# EAGLE design EMILL (EAGLE 9.5.1)
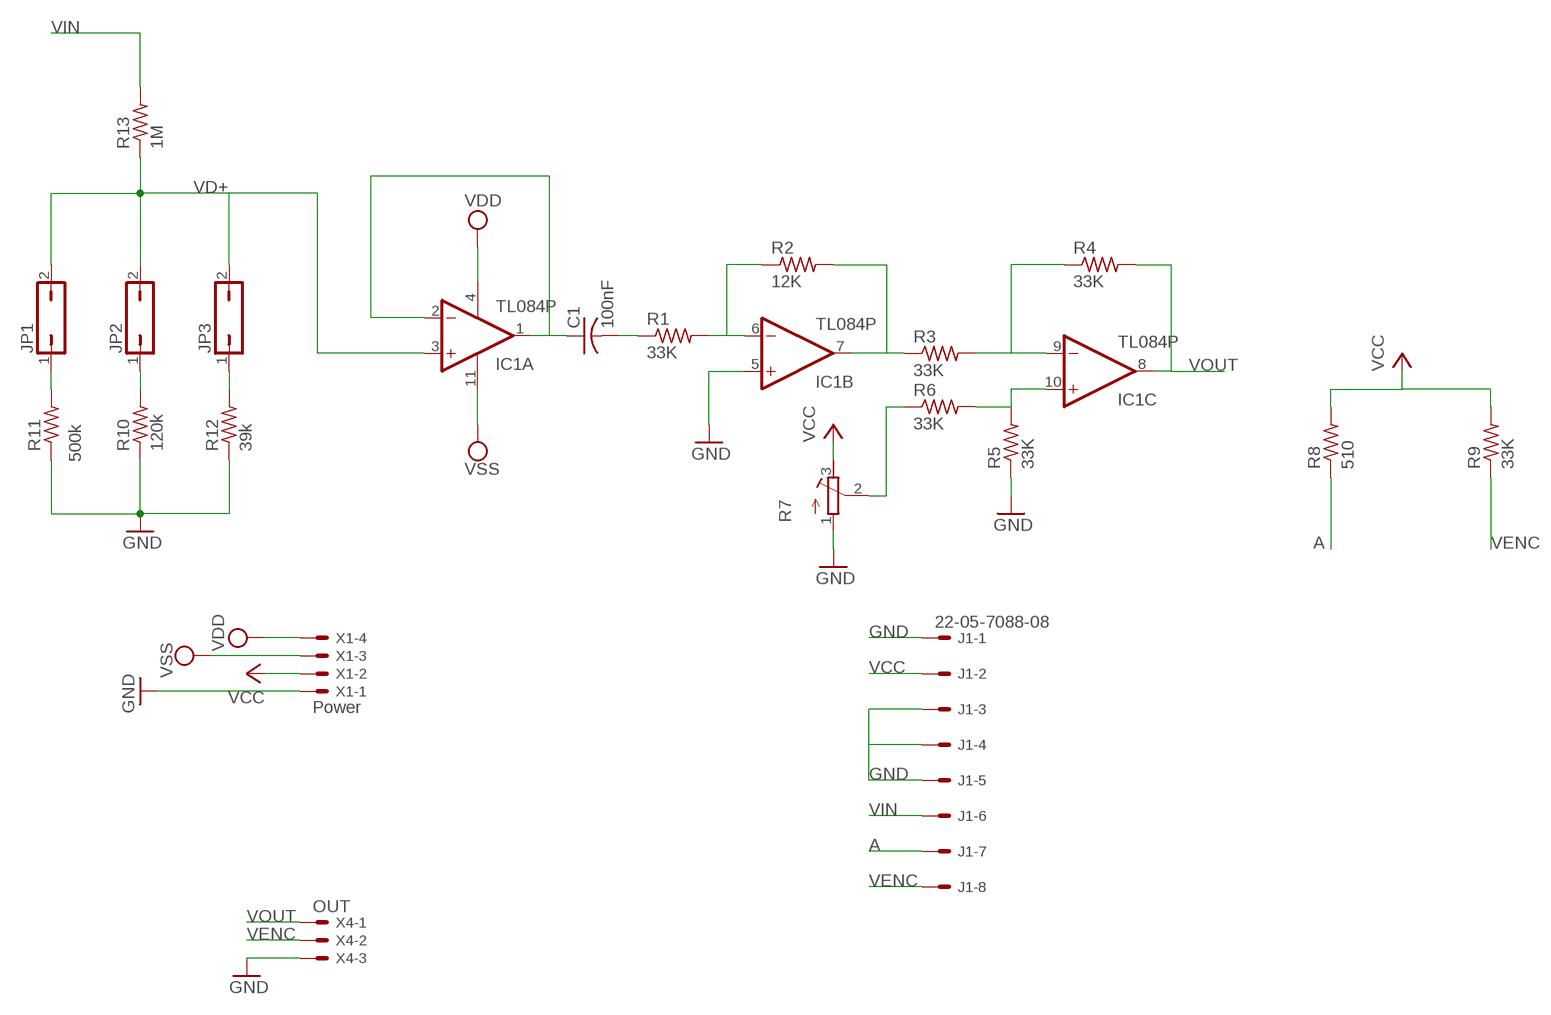
[diagram p0: schematic, sheet 1]

## Parts
C1  100nF  C-US025-025X050  [C025-025X050]
IC1  TL084P  [DIL14]
J1  22-05-7088-08  [7395-08]
JP1  JP1Q  [JP1]
JP2  JP1Q  [JP1]
JP3  JP1Q  [JP1]
R1  33K  R-US_0207/10  [0207/10]
R2  12K  R-US_0207/10  [0207/10]
R3  33K  R-US_0207/10  [0207/10]
R4  33K  R-US_0207/10  [0207/10]
R5  33K  R-US_0207/10  [0207/10]
R6  33K  R-US_0207/10  [0207/10]
R7  R-TRIMM64W  [RTRIM64W]
R8  510  R-US_0207/10  [0207/10]
R9  33K  R-US_0207/10  [0207/10]
R10  120k  R-US_0207/10  [0207/10]
R11  500k  R-US_0207/10  [0207/10]
R12  39k  R-US_0207/10  [0207/10]
R13  1M  R-US_0207/10  [0207/10]
X1  Power  22-23-2041  [22-23-2041]
X4  OUT  22-23-2031  [22-23-2031]

## Nets
A: J1.7 R8.1
GND: IC1.5(B:+IN) J1.1 J1.3 J1.4 J1.5 R5.1 R7.1(A) R10.1 R11.1 R12.1 X1.1 X4.3
N$1: C1.1 IC1.1(A:OUT) IC1.2(A:-IN)
N$2: C1.2 R1.1
N$3: IC1.6(B:-IN) R1.2 R2.1
N$4: IC1.7(B:OUT) R2.2 R3.1
N$5: IC1.9(C:-IN) R3.2 R4.1
N$6: IC1.10(C:+IN) R5.2 R6.2
N$8: R6.1 R7.2(S)
N$13: JP2.1 R10.2
N$14: JP3.1 R12.2
N$15: JP1.1 R11.2
VCC: J1.2 R7.3(E) R8.2 R9.2 X1.2
VD+: IC1.3(A:+IN) JP1.2 JP2.2 JP3.2 R13.1
VDD: IC1.4(P:V+) X1.4
VENC: J1.8 R9.1 X4.2
VIN: J1.6 R13.2
VOUT: IC1.8(C:OUT) R4.2 X4.1
VSS: IC1.11(P:V-) X1.3
Unconnected: IC1.12(D:+IN) IC1.13(D:-IN) IC1.14(D:OUT)

## Library data of the parts
C1 = rcl:C-US: CAPACITOR, American symbol
IC1 = linear:TL084: OP AMP
J1 = con-molex:22-?-08: CONNECTOR wire to board 2.54 mm (.1 inch) pitch header; MF: MOLEX; OC_FARNELL: unknown; OC_NEWARK: unknown
JP1-JP3 = jumper:JP1Q: JUMPER
R1-R6 R8-R13 = rcl:R-US_: RESISTOR, American symbol
R7 = rcl:R-TRIMM: Trimm resistor
X1 = con-molex:22-23-2041: .100" (2.54mm) Center Header - 4 Pin; MF: MOLEX; MPN: 22-23-2041; OC_FARNELL: 1462920; OC_NEWARK: 38C0355
X4 = con-molex:22-23-2031: .100" (2.54mm) Center Header - 3 Pin; MF: MOLEX; MPN: 22-23-2031; OC_FARNELL: 1462950; OC_NEWARK: 30C0862

## Board
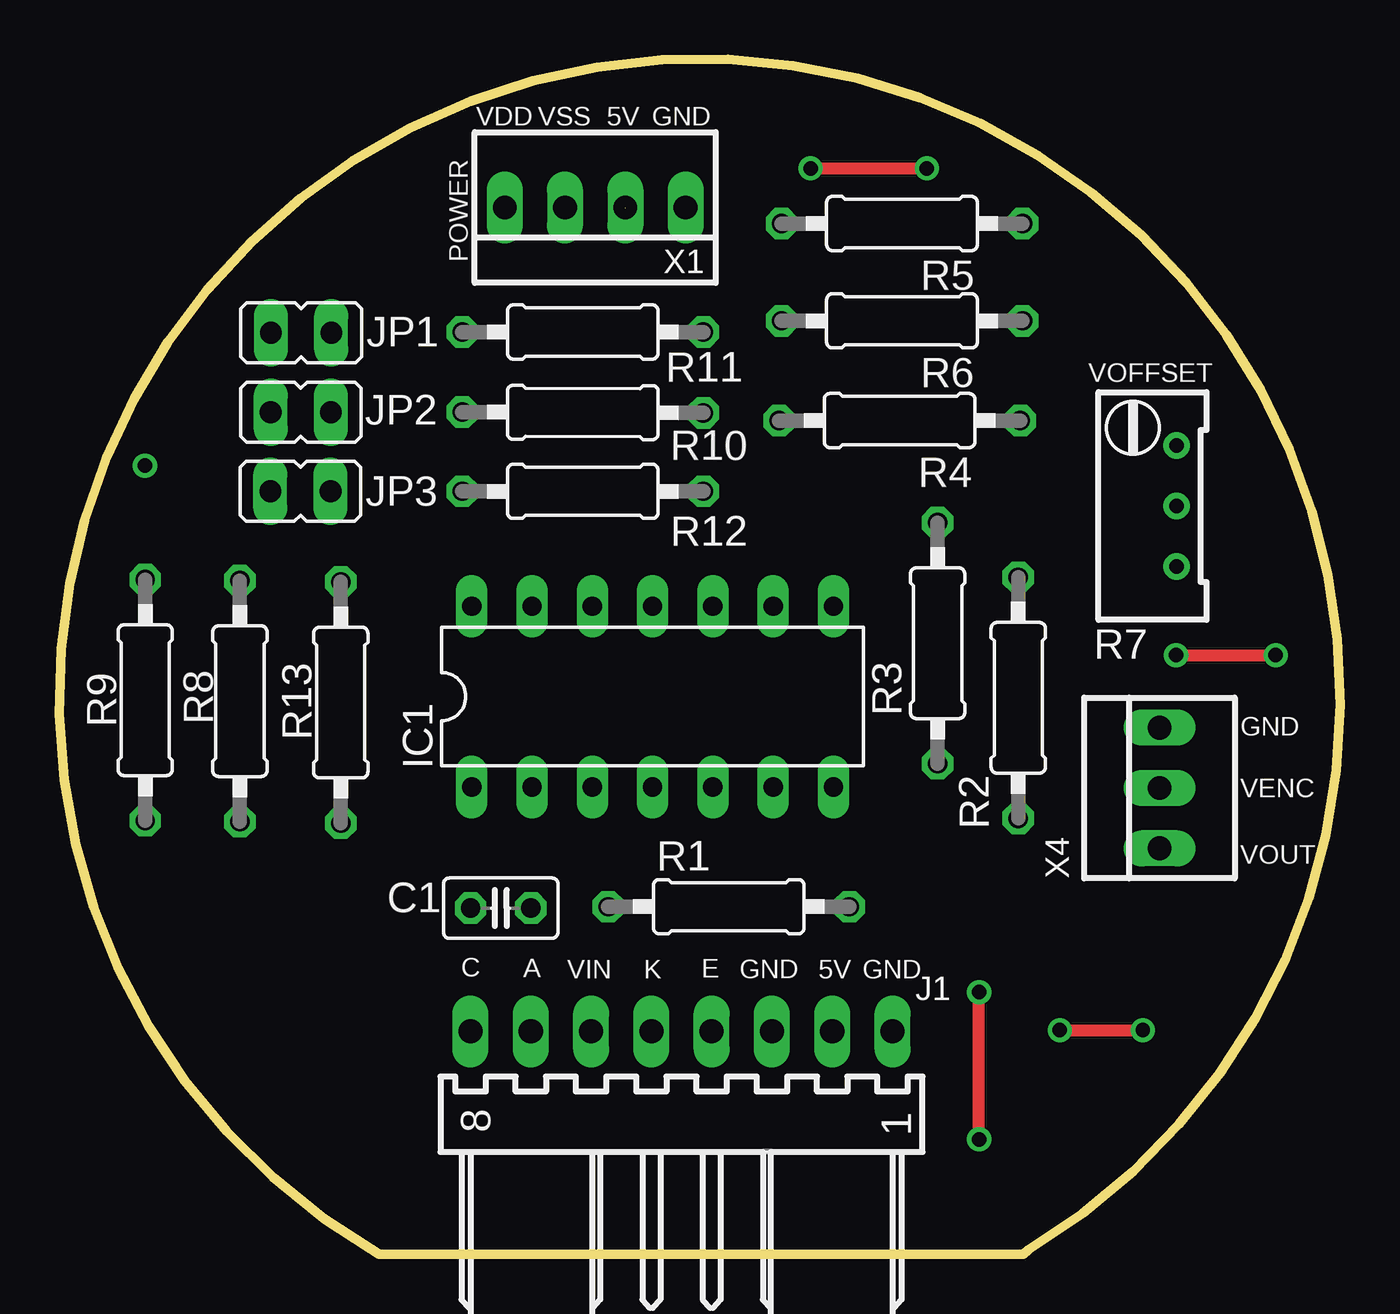
[diagram p1: board, top side]
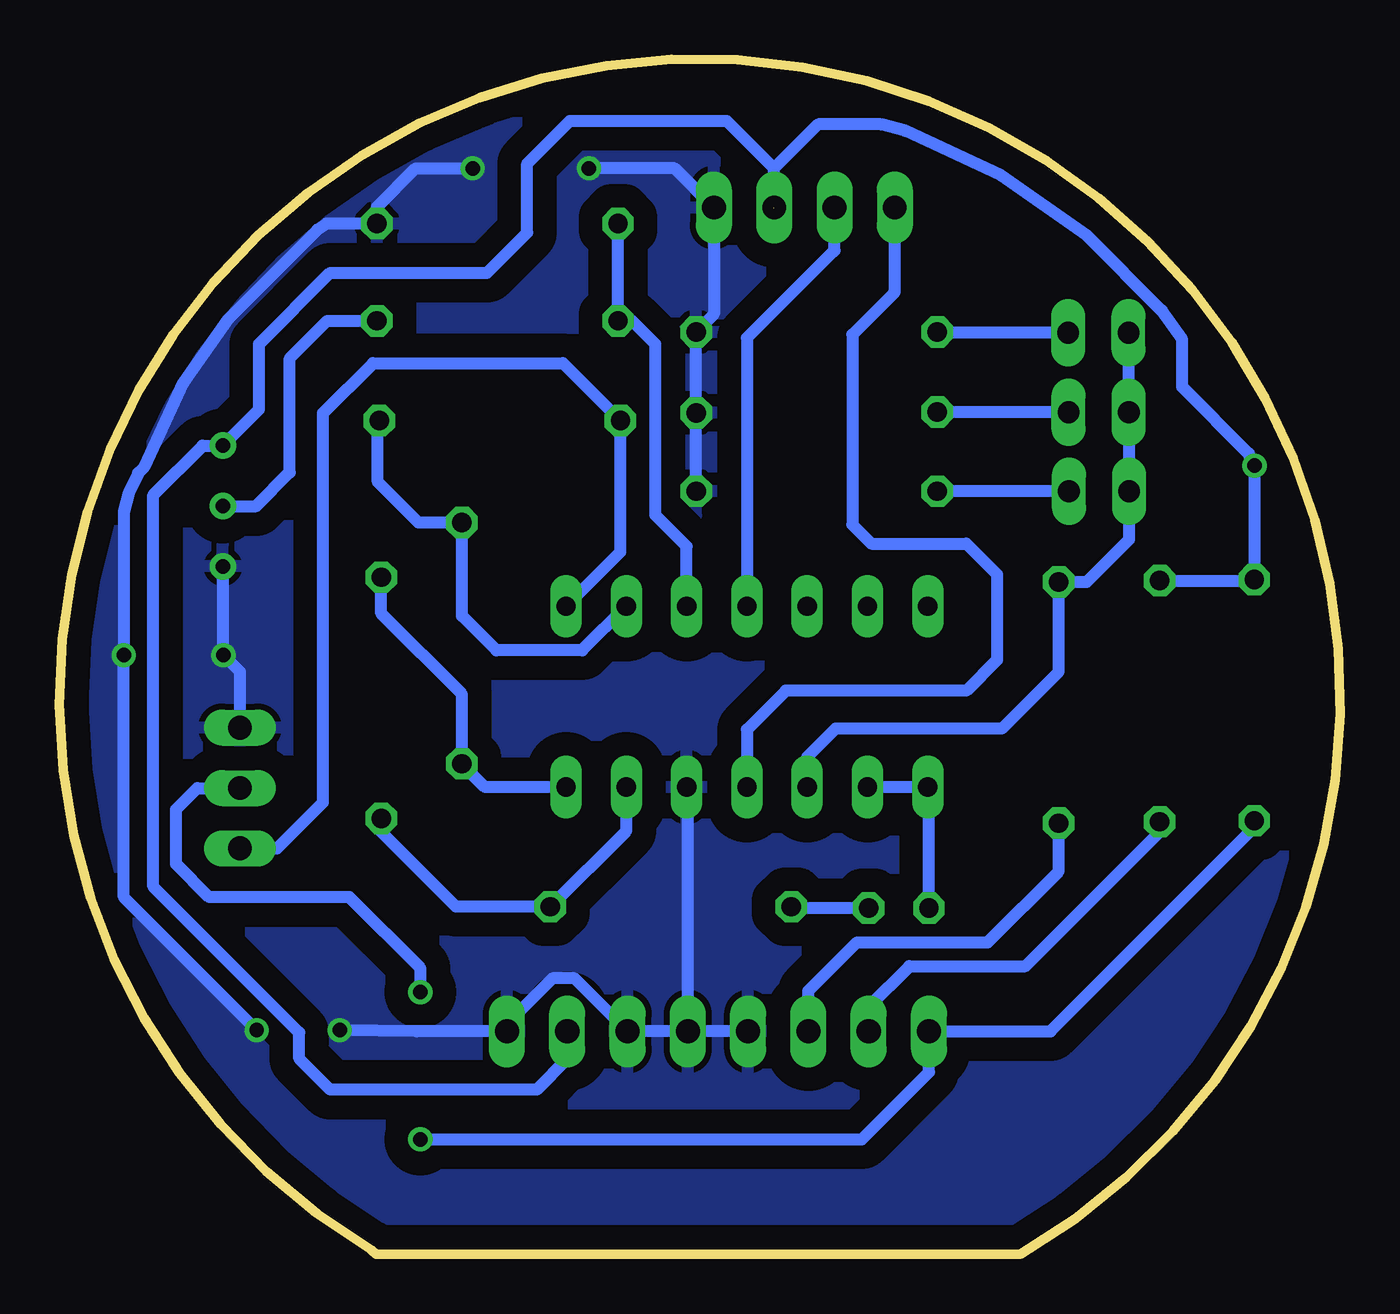
[diagram p2: board, bottom side, seen from below]

Size 53.97 x 50.35 mm. Coordinates in mm from the lower left corner, seen from the top.
Outline: 13.48,0.01 arc-299 40.83,0.21 40.62,0 13.5,0
Copper layers (1*16): Top 0.035mm / dielectric 1.5mm / Bottom 0.035mm
Design rules "default": minimum track width 10mil, minimum drill 24mil, track to track 8mil, track to pad 8mil, pad to pad 8mil, via to via 8mil, smd to smd 8mil, copper to edge 40mil, drill to drill 8mil, minimum pad ring 10mil, minimum via ring 8mil, stop-mask expansion 4mil, vias tented up to drill 0mil, thermal gap 10mil

### Footprints (pad centres in the part's own frame; a part is rotated, then mirrored left to right if it is on the bottom)
C025-025X050 = drill 0.813 octagon: 1 -1.27,0; 2 1.27,0
DIL14 = drill 0.813 long: 1 -7.62,-3.81; 2 -5.08,-3.81; 3 -2.54,-3.81; 4 0,-3.81; 5 2.54,-3.81; 6 5.08,-3.81; 7 7.62,-3.81; 8 7.62,3.81; 9 5.08,3.81; 10 2.54,3.81; 11 0,3.81; 12 -2.54,3.81; 13 -5.08,3.81; 14 -7.62,3.81
7395-08 = drill 1.016 long: 1 8.89,0; 2 6.35,0; 3 3.81,0; 4 1.27,0; 5 -1.27,0; 6 -3.81,0; 7 -6.35,0; 8 -8.89,0
JP1 = drill 0.914 long: 1 0,-1.27; 2 0,1.27
0207/10 = drill 0.813 octagon: 1 -5.08,0; 2 5.08,0
RTRIM64W = drill 0.61: 1 1.27,-2.54; 2 1.27,0; 3 1.27,2.54
22-23-2041 = drill 1 long: 1 -3.81,0; 2 -1.27,0; 3 1.27,0; 4 3.81,0
22-23-2031 = drill 1 long: 1 -2.54,0; 2 0,0; 3 2.54,0

### Placement (x,y rotation side)
C1  18.6,14.59 0 top
IC1  25,23.5 0 top
J1  26.22,9.4 0 top
JP1  10.19,38.83 90 top
JP2  10.18,35.48 90 top
JP3  10.16,32.15 90 top
R1  28.21,14.65 0 top
R2  40.41,23.45 90 top
R3  37.01,25.75 90 top
R4  35.41,35.13 180 top
R5  35.51,43.43 180 top
R6  35.51,39.33 180 top
R7  45.82,31.53 0 top
R8  7.61,23.31 90 top
R9  3.62,23.35 90 top
R10  22.06,35.47 179.8 top
R11  22.06,38.86 180 top
R12  22.06,32.15 180 top
R13  11.86,23.25 270 top
X1  22.58,44.1 180 top
X4  46.36,19.65 90 top

### Tracks (layer width: path | path; a pad name or v marks a point on that pad's centre or on a via)
A
  Bottom 0.508: R8.1 7.61,17.8 13.26,12.15 18.16,12.15 19.88,10.43 19.87,10.42 J1.7
GND  (via drill 0.61)
  Top 0.508: v31.66,45.75 v36.56,45.75 | v47.06,25.25 v51.26,25.25 | v42.16,9.45 v45.66,9.45
  Bottom 0.5: 28.08,45.75 28.04,45.75 X1.1 26.39,39.61 R11.1 R12.1
  Bottom 0.508: R7.1 47.09,25.28 v47.06,25.25 46.36,24.55 X4.3 | v42.16,9.45 38.91,9.4 J1.1 35.11,9.72 33.2,11.63 32.26,11.63 J1.3 J1.5 | 31.86,45.65 31.76,45.75 v31.66,45.75 28.08,45.75 | 36.46,45.75 v36.56,45.75 38.96,45.75 40.59,44.12 R5.1 42.72,43.43 43.09,43.17 46.88,39.38 48.73,36.74 50.38,33.19 50.66,32.92 51.05,32.08 51.26,31.29 v51.26,25.25 51.26,15.05 v45.66,9.45 | J1.4 27.49,19.64 IC1.5 | R10.1
  pour Bottom (isolate 1): 0.06,26.15 arc-10 0.86,30.85 arc-26 6.36,41.35 arc-34 20.26,50.05 arc-79 51.86,35.45 arc-59 50.06,7.85 arc-55 28.46,-4.25 arc-59 4.76,8.35 arc-36 0.16,26.35
N$1
  Bottom 0.508: C1.1 17.33,19.64 IC1.1 IC1.2
N$2
  Bottom 0.508: C1.2 23.07,14.59 R1.1
N$3
  Bottom 0.508: IC1.6 30.08,17.86 R1.2 37.26,14.65 40.41,17.8 R2.1
N$4
  Bottom 0.508: IC1.7 36.03,19.69 R3.1 37.01,23.6 40.41,27 R2.2
N$5
  Bottom 0.508: IC1.9 31.94,25.45 35.56,25.45 37.01,26.9 R3.2 38.84,30.83 40.56,32.55 40.56,35.06 R4.1
N$6
  Bottom 0.508: IC1.10 27.54,29.83 28.86,31.15 28.86,38.35 29.84,39.33 R6.2 R5.2
N$8
  Bottom 0.508: R7.2 45.68,31.53 44.26,32.95 44.26,37.75 42.68,39.33 R6.1
N$13
  Bottom 0.5: JP2.1 16.95,35.48 16.96,35.47
  Bottom 0.508: 16.96,35.47 R10.2
N$14
  Bottom 0.508: JP3.1 R12.2
N$15
  Bottom 0.5: JP1.1 16.95,38.83 R11.2
VCC  (via drill 0.61)  (1 unrouted)
  Bottom 0.508: 23.86,44.07 23.86,45.75 | 23.86,45.75 22,47.61 19.35,47.61 18.33,47.34 14.3,45.46 10.65,42.91 7.5,39.76 6.66,38.55 6.66,36.55 3.84,33.73 v3.61,33.23 R9.2 3.66,28.39 R8.2 | 23.86,45.75 25.86,47.75 32.46,47.75 34.26,45.95 34.26,43.05 35.96,41.35 42.56,41.35 45.56,38.35 45.56,35.6 R7.3 47.94,34.07 50.01,32 50.01,15.5 43.86,9.35 43.86,8.25 42.56,6.95 33.86,6.95 32.57,8.24 J1.2
VD+
  Bottom 0.5: JP3.2 8.89,35.46 JP2.2 JP1.2
  Bottom 0.508: IC1.3 22.46,20.95 21.26,22.15 14.26,22.15 11.86,24.55 R13.1 10.68,28.33 8.89,30.12 JP3.2
VDD
  Bottom 0.5: 18.81,40.5 18.77,40.54 X1.4
  Bottom 0.508: 18.81,40.5 20.56,38.75 20.56,30.75 19.76,29.95 15.76,29.95 14.46,28.65 14.46,25.05 15.76,23.75 23.36,23.75 25,22.11 IC1.4
VENC  (via drill 0.61)
  Top 0.508: v38.76,4.85 v38.76,11.05
  Bottom 0.508: 38.76,10.85 v38.76,11.05 38.76,12.05 41.76,15.05 47.66,15.05 49.06,16.45 49.06,18.75 48.16,19.65 X4.2 | v38.76,4.85 20.16,4.85 17.33,7.68 J1.8 12.21,9.4 3.62,17.99 R9.1
VIN
  Bottom 0.508: R13.2 11.86,16.15 14.86,13.15 20.36,13.15 22.42,11.09 22.41,11.08 J1.6
VOUT
  Bottom 0.508: IC1.8 30.33,29.6 R4.2 32.75,37.55 40.76,37.55 42.86,35.45 42.86,19.05 44.8,17.11 X4.1
VSS
  Bottom 0.5: 21.35,42.26 21.31,42.3 X1.3
  Bottom 0.508: IC1.11 25,38.61 21.35,42.26

### Text on the board
tPlace: POWER | VOFFSET
tNames: VDD | VSS | 5V | GND | GND | VENC | VOUT | C | A | VIN | K | E | GND | 5V | GND